# Altium schematic sheet cell_fuses.SchDoc: foxBMS BMS-Slave 12-Cell
size A3; DocumentNumber: 3; SheetNumber: 3; SheetTotal: 21; AUTHOR: Fraunhofer IISB foxBMS Team; SheetDescription: Cell Voltage Sense Fuses
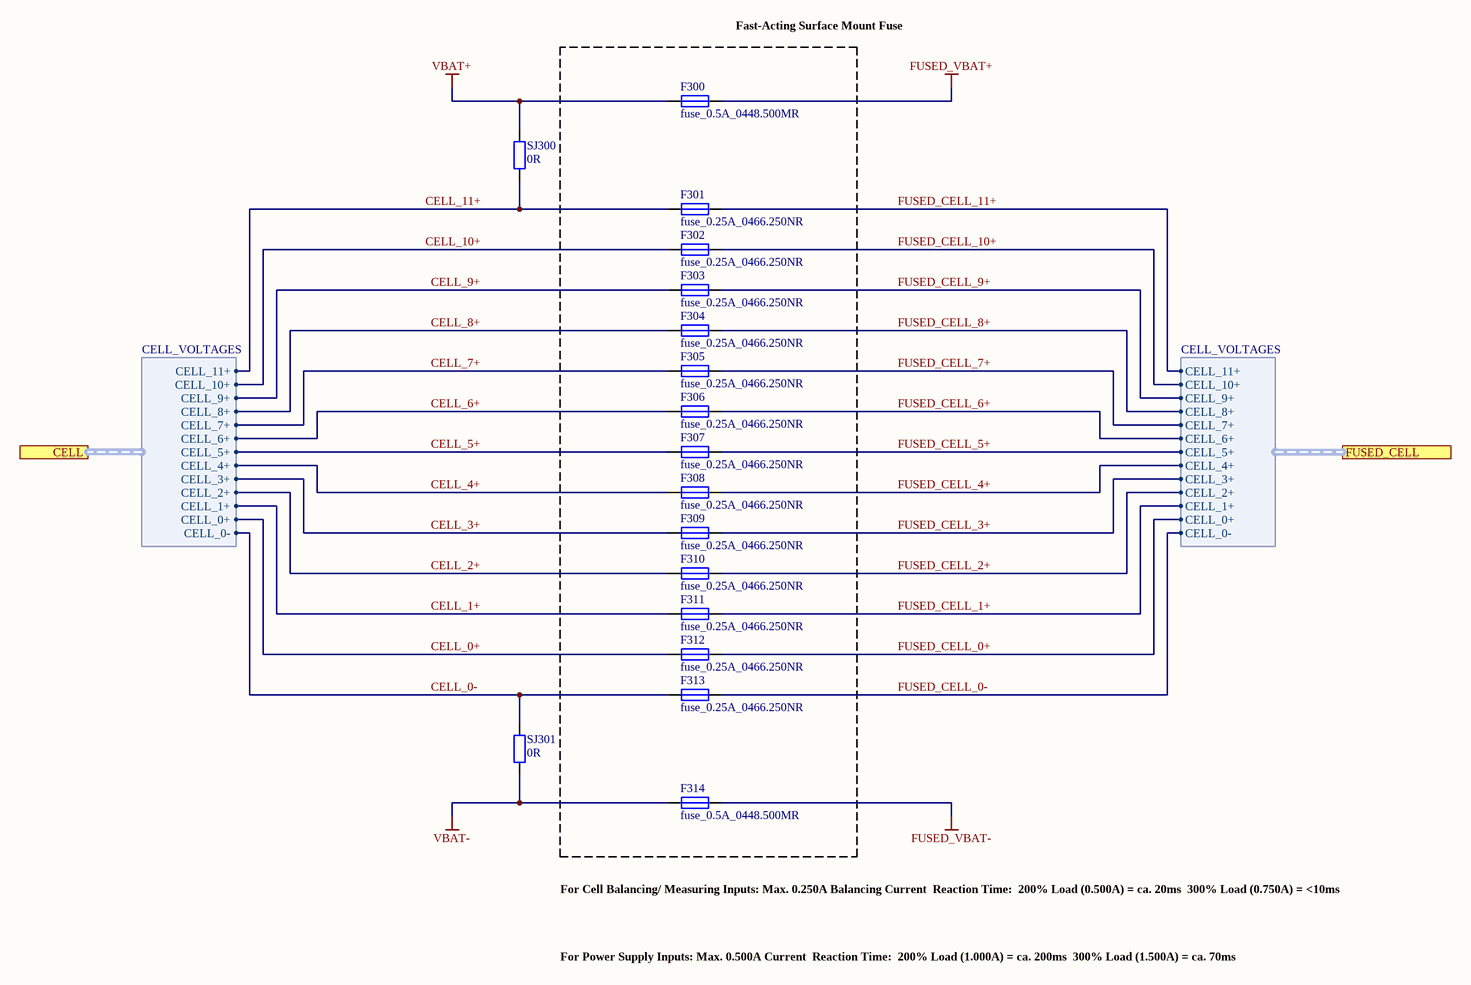
[diagram p0: cell_fuses.SchDoc]

## Parts
F300  fuse_0.5A_0448.500MR  [LITTLEFUSE_448]
F301  fuse_0.25A_0466.250NR  [LITTLEFUSE_466]
F302  fuse_0.25A_0466.250NR  [LITTLEFUSE_466]
F303  fuse_0.25A_0466.250NR  [LITTLEFUSE_466]
F304  fuse_0.25A_0466.250NR  [LITTLEFUSE_466]
F305  fuse_0.25A_0466.250NR  [LITTLEFUSE_466]
F306  fuse_0.25A_0466.250NR  [LITTLEFUSE_466]
F307  fuse_0.25A_0466.250NR  [LITTLEFUSE_466]
F308  fuse_0.25A_0466.250NR  [LITTLEFUSE_466]
F309  fuse_0.25A_0466.250NR  [LITTLEFUSE_466]
F310  fuse_0.25A_0466.250NR  [LITTLEFUSE_466]
F311  fuse_0.25A_0466.250NR  [LITTLEFUSE_466]
F312  fuse_0.25A_0466.250NR  [LITTLEFUSE_466]
F313  fuse_0.25A_0466.250NR  [LITTLEFUSE_466]
F314  fuse_0.5A_0448.500MR  [LITTLEFUSE_448]
SJ300  0R  [RESC1608X05N]
SJ301  0R  [RESC1608X05N]

## Blocks framed on the sheet
Fast-Acting Surface Mount Fuse: F300-F314

## Ports
CELL (harness CELL_VOLTAGES), FUSED_CELL (harness CELL_VOLTAGES)

## Harnesses
CELL_VOLTAGES: CELL_0-, CELL_0+, CELL_1+, CELL_10+, CELL_11+, CELL_2+, CELL_3+, CELL_4+, CELL_5+, CELL_6+, CELL_7+, CELL_8+, CELL_9+

## Nets
FUSED_VBAT+: F300.2
FUSED_VBAT-: F314.2
VBAT+: F300.1 SJ300.1
VBAT-: F314.1 SJ301.2
CELL_0+: F312.1 ; port CELL.CELL_0+
CELL_0-: F313.1 SJ301.1 ; port CELL.CELL_0-
CELL_1+: F311.1 ; port CELL.CELL_1+
CELL_2+: F310.1 ; port CELL.CELL_2+
CELL_3+: F309.1 ; port CELL.CELL_3+
CELL_4+: F308.1 ; port CELL.CELL_4+
CELL_5+: F307.1 ; port CELL.CELL_5+
CELL_6+: F306.1 ; port CELL.CELL_6+
CELL_7+: F305.1 ; port CELL.CELL_7+
CELL_8+: F304.1 ; port CELL.CELL_8+
CELL_9+: F303.1 ; port CELL.CELL_9+
CELL_10+: F302.1 ; port CELL.CELL_10+
CELL_11+: F301.1 SJ300.2 ; port CELL.CELL_11+
FUSED_CELL_0+: F312.2 ; port FUSED_CELL.CELL_0+
FUSED_CELL_0-: F313.2 ; port FUSED_CELL.CELL_0-
FUSED_CELL_1+: F311.2 ; port FUSED_CELL.CELL_1+
FUSED_CELL_2+: F310.2 ; port FUSED_CELL.CELL_2+
FUSED_CELL_3+: F309.2 ; port FUSED_CELL.CELL_3+
FUSED_CELL_4+: F308.2 ; port FUSED_CELL.CELL_4+
FUSED_CELL_5+: F307.2 ; port FUSED_CELL.CELL_5+
FUSED_CELL_6+: F306.2 ; port FUSED_CELL.CELL_6+
FUSED_CELL_7+: F305.2 ; port FUSED_CELL.CELL_7+
FUSED_CELL_8+: F304.2 ; port FUSED_CELL.CELL_8+
FUSED_CELL_9+: F303.2 ; port FUSED_CELL.CELL_9+
FUSED_CELL_10+: F302.2 ; port FUSED_CELL.CELL_10+
FUSED_CELL_11+: F301.2 ; port FUSED_CELL.CELL_11+

## Notes on the sheet
- For Cell Balancing/ Measuring Inputs: Max. 0.250A Balancing Current
  Reaction Time:
  200% Load (0.500A) = ca. 20ms
  300% Load (0.750A) = <10ms
- For Power Supply Inputs: Max. 0.500A Current
  Reaction Time:
  200% Load (1.000A) = ca. 200ms
  300% Load (1.500A) = ca. 70ms
- Fraunhofer IISB
- Schottkystr. 10
- developed by:
- 91058 Erlangen
- Germany
- Author
- Project
- License
- Description
- File
- Version
- Release Date
- Sheet
- www.foxbms.org
- www.iisb.fraunhofer.de
- foxBMS Team
- /

## Library data of the parts
F300 F314 = fuse_0.5A_0448.500MR: Fuse, Surface Mount, NANO2 Series, 500 mA, 125 VAC, 32 VDC, Very Fast Acting, SMD; Manufacturer: Littlefuse; Automotive Qualified: False; Part Number: fuse_0.5A_0448.500MR; Operating Temperature: -55°C - +125°C; ComponentLink1Description: Datasheet; ComponentLink1URL: http://www.farnell.com/datasheets/1792947.pdf; Supplier 1: Farnell; Supplier Part Number 1: 1596919
F301-F313 = fuse_0.25A_0466.250NR: Fuse, Surface Mount, 466 Series, 250 mA, 125 VAC, 125 VDC, Very Fast Acting, 1206; Manufacturer: Littlefuse; Automotive Qualified: False; Part Number: fuse_0.25A_0466.250NR; Operating Temperature: -55°C - +90°C; ComponentLink1Description: Datasheet; ComponentLink1URL: http://www.farnell.com/datasheets/1796765.pdf; Supplier 1: Farnell; Supplier Part Number 1: 9921826
SJ300 SJ301 = gen_R_0R_0603: SMD Resistor 0R 0603; Power: 0.1W; Case EIA: 0603; Case Metric: 1608; Maximum Working Voltage: 75V; PnP Package: R_0603; Automotive Qualified: False; Part Number: gen_R_0R_0603; Operating Temperature: -55°C - +155°C; Resistance: 0R; Series: Jumper; PnP Value: 0R; Supplier 1: Farnell; Supplier Part Number 1: 2073345